# Altium schematic sheet ROLETA2-A1-P01.SchDoc
size A3
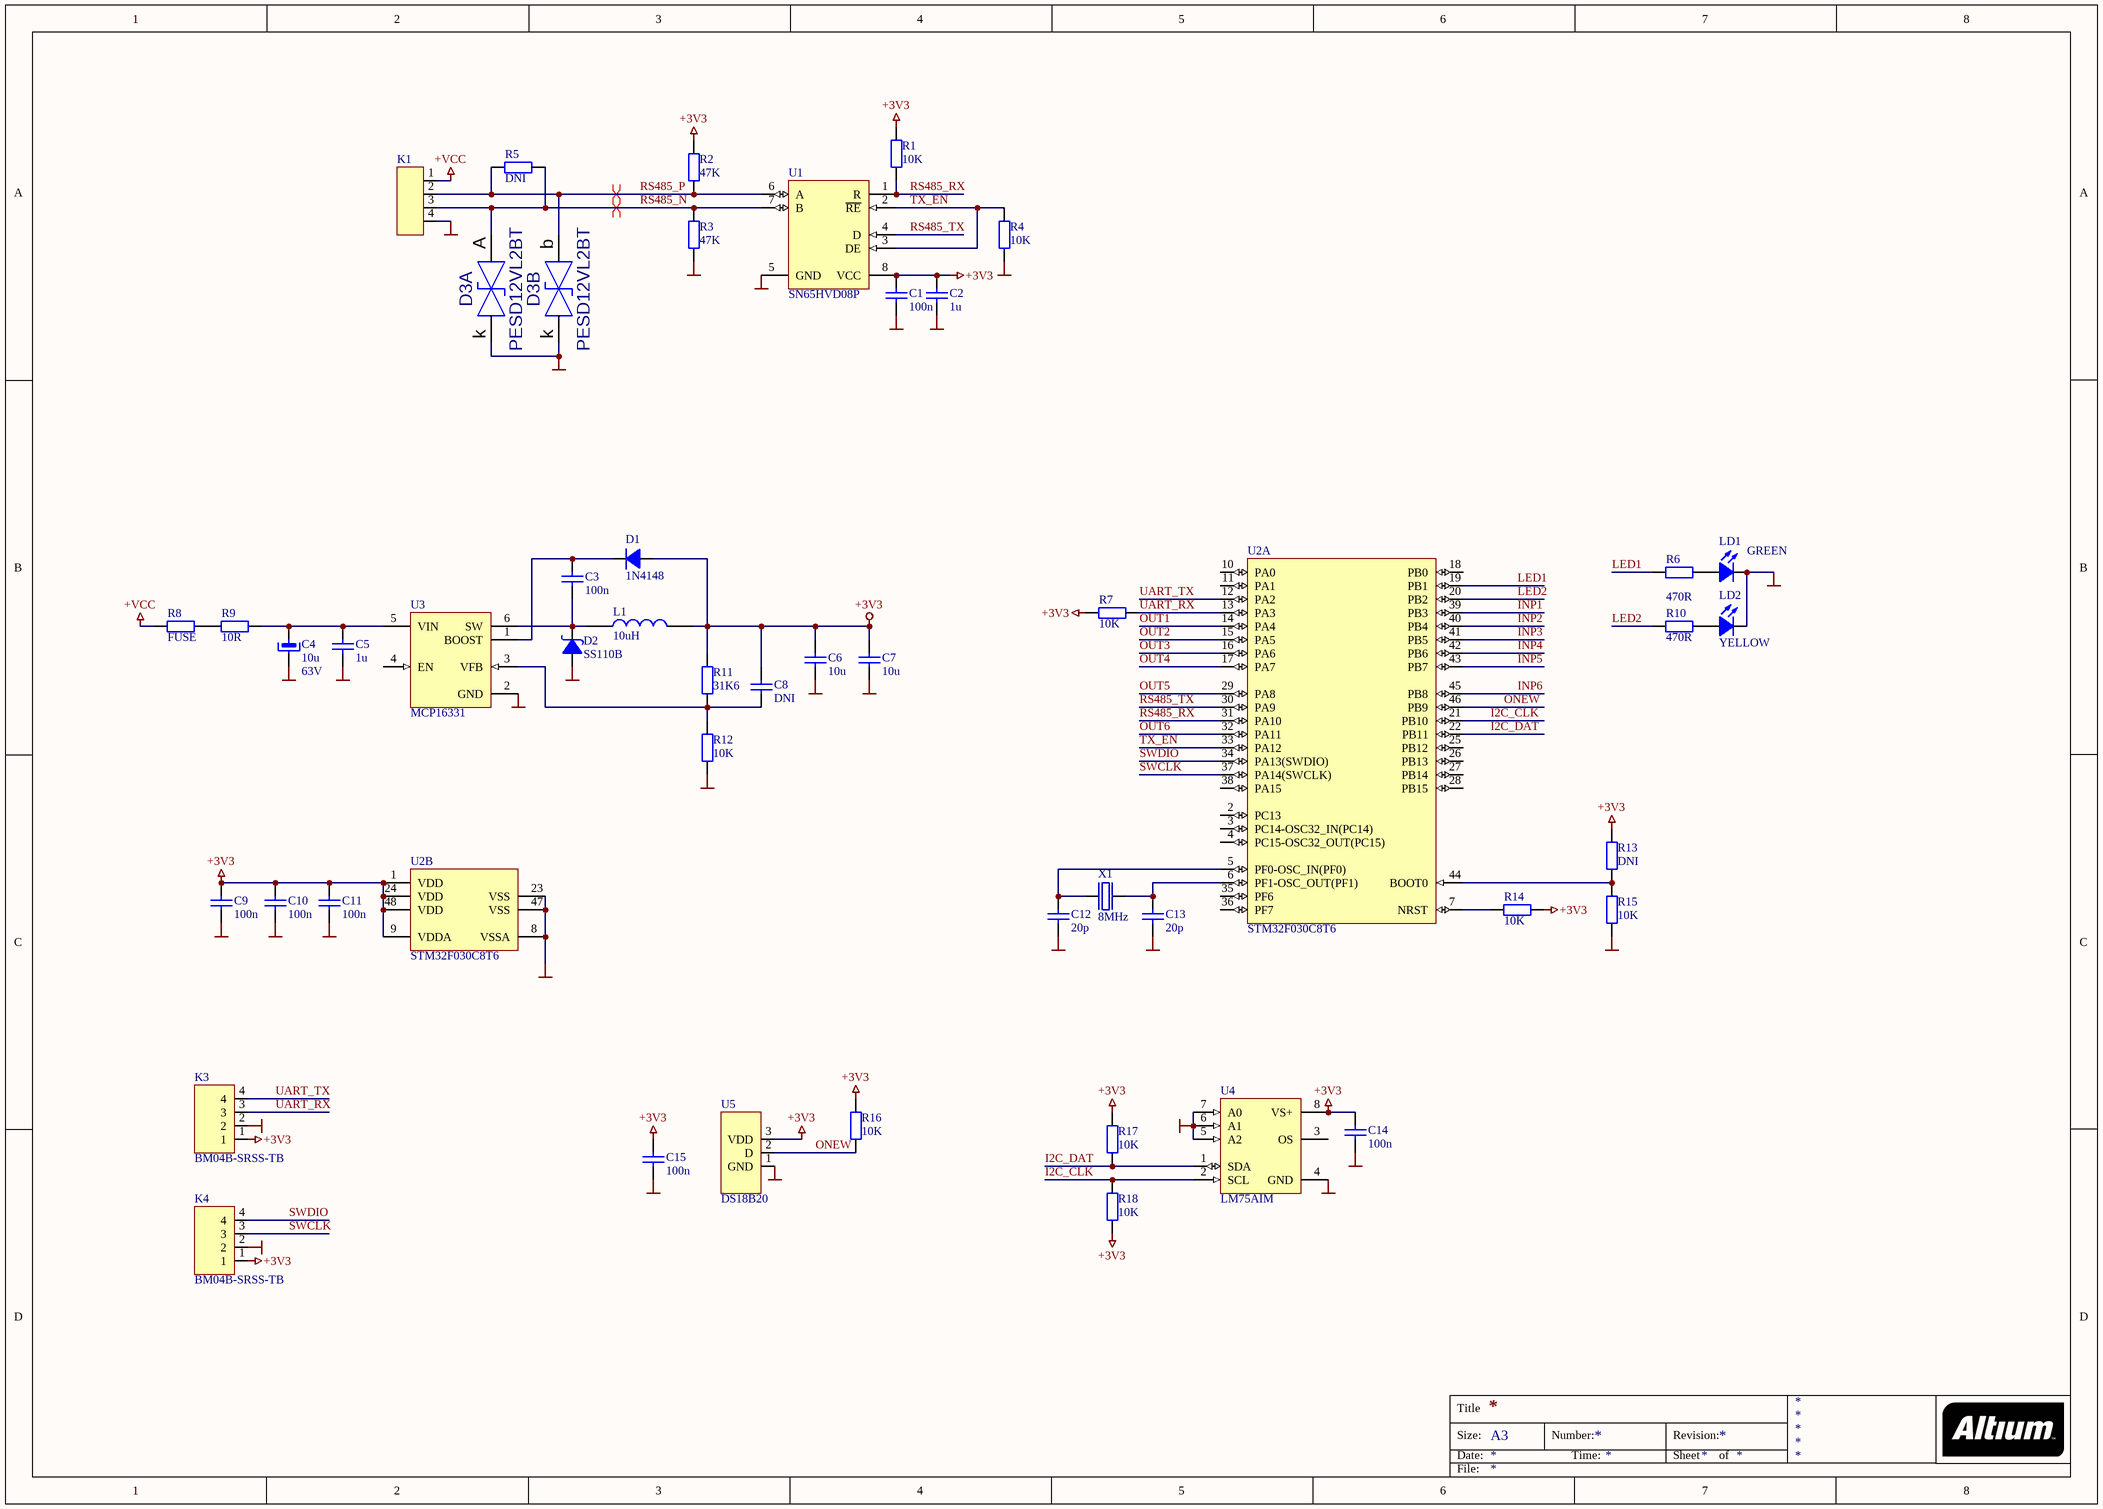
[diagram p0: ROLETA2-A1-P01.SchDoc]

## Parts
C1  100n  [CC0805-1]
C2  1u  [CC0805-1]
C3  100n  [CC0805-1]
C4  10u  Comment2: 63V  [CAPPS-D6.3X7.7]
C5  1u  [CC0805-1]
C6  10u  [CC0805-1]
C7  10u  [CC0805-1]
C8  DNI  [CC0805-1]
C9  100n  [CC0805-1]
C10  100n  [CC0805-1]
C11  100n  [CC0805-1]
C12  20p  [CC0805-1]
C13  20p  [CC0805-1]
C14  100n  [CC0805-1]
C15  100n  [CC0805-1]
D1  1N4148  [SOD323]
D2  SS110B  [DO-214AC]
D3  PESD12VL2BT  [SOT-23_NUP2105L(Primary)]  (parts A,B of 2)
K1  Terminal Block Connector, 3.81mm, Right Angle  [CONN_3.81_4]  (value not drawn)
K3  BM04B-SRSS-TB  [JST-SH-4pin]
K4  BM04B-SRSS-TB  [JST-SH-4pin]
L1  10uH  [IND-LQH32CN4R7M33l]
LD1  GREEN  [LEDGREENC190]
LD2  YELLOW  [LEDYELLOWC190]
R1  10K  [RC0805-1]
R2  47K  [RC0805-1]
R3  47K  [RC0805-1]
R4  10K  [RC0805-1]
R5  DNI  [RC0805-1]
R6  470R  [RC0805-1]
R7  10K  [RC0805-1]
R8  FUSE  [RC1206-1]
R9  10R  [RC0805-1]
R10  470R  [RC0805-1]
R11  31K6  [RC0805-1]
R12  10K  [RC0805-1]
R13  DNI  [RC0805-1]
R14  10K  [RC0805-1]
R15  10K  [RC0805-1]
R16  10K  [RC0805-1]
R17  10K  [RC0805-1]
R18  10K  [RC0805-1]
U1  SN65HVD08P  [P8]
U2  STM32F030C8T6  [STM-LQFP48_N]  (parts A,B of 2)
U3  MCP16331  [MCHP-SOT-23-CH6_N]
U4  LM75AIM  [M08A_N]
U5  DS18B20  [TO92]
X1  8MHz  [OSCCC150X320X9-2N]

## Nets
+3V3: C1.2 C2.2 C6.2 C7.2 C8.2 C9.2 C10.2 C11.2 C14.2 C15.2 D1.2(A) K3.1 K4.1 L1.2 R1.2 R2.2 R7.1 R11.2 R13.2 R14.1 R16.1 R17.1 R18.1 U1.8(VCC) U2.1(VDD) U2.9(VDDA) U2.24(VDD) U2.48(VDD) U4.8(VS+) U5.3(VDD)
+VCC: K1.1(A) R8.1
GND: C1.1 C2.1 C4.2 C5.1 C6.1 C7.1 C9.1 C10.1 C11.1 C12.1 C13.1 C14.1 C15.1 D2.A D3.k(K) K1.4(K) K3.2 K4.2 LD1.1(C) LD2.1(C) R3.1 R4.1 R12.1 R15.2 U1.5(GND) U2.8(VSSA) U2.23(VSS) U2.47(VSS) U3.2(GND) U4.4(GND) U4.5(A2) U4.6(A1) U4.7(A0) U5.1(GND)
I2C_CLK: R18.2 U2.21(PB10) U4.2(SCL)
I2C_DAT: R17.2 U2.22(PB11) U4.1(SDA)
INP1: U2.39(PB3)
INP2: U2.40(PB4)
INP3: U2.41(PB5)
INP4: U2.42(PB6)
INP5: U2.43(PB7)
INP6: U2.45(PB8)
LED1: R6.1 U2.19(PB1)
LED2: R10.1 U2.20(PB2)
ONEW: R16.2 U2.46(PB9) U5.2(D)
OUT1: U2.14(PA4)
OUT2: U2.15(PA5)
OUT3: U2.16(PA6)
OUT4: U2.17(PA7)
OUT5: U2.29(PA8)
OUT6: U2.32(PA11)
RS485_N: D3.A K1.3(A) R3.2 R5.2 U1.7(B)
RS485_P: D3.b(A) K1.2(K) R2.1 R5.1 U1.6(A)
RS485_RX: R1.1 U1.1(R) U2.31(PA10)
RS485_TX: U1.4(D) U2.30(PA9)
SWCLK: K4.3 U2.37(PA14(SWCLK))
SWDIO: K4.4 U2.34(PA13(SWDIO))
TX_EN: R4.2 U1.2(~{RE}) U1.3(DE) U2.33(PA12)
UART_RX: K3.3 R7.2 U2.13(PA3)
UART_TX: K3.4 U2.12(PA2)
NetC3_1: C3.1 D2.K L1.1 U3.6(SW)
NetC3_2: C3.2 D1.1(C) U3.1(BOOST)
NetC4_1: C4.1 C5.2 R9.1 U3.5(VIN)
NetC8_1: C8.1 R11.1 R12.2 U3.3(VFB)
NetC12_2: C12.2 U2.5(PF0-OSC_IN(PF0)) X1.1(OUT)
NetC13_2: C13.2 U2.6(PF1-OSC_OUT(PF1)) X1.2(IN)
NetLD1_2: LD1.2(A) R6.2
NetLD2_2: LD2.2(A) R10.2
NetR8_2: R8.2 R9.2
NetR13_1: R13.1 R15.1 U2.44(BOOT0)
NetR14_2: R14.2 U2.7(NRST)

Not connected (* = marked no-connect by the designer): U2 2(PC13) 3(PC14-OSC32_IN(PC14)) 4(PC15-OSC32_OUT(PC15)) 10(PA0) 11(PA1) 18(PB0) 25(PB12) 26(PB13) 27(PB14) 28(PB15) 35(PF6) 36(PF7) 38(PA15); U3 4(EN); U4 3(OS)

## Layout directives
differential pair: RS485_N, RS485_P

## Notes on the sheet
- Title
- Size:
- Date:
- A3
- Number:
- Time:
- Revision:
- Sheet
- of
- File:

## Library data of the parts
C1-C3 C5 C8 = CAPCC0805_1U50VX7R: Capacitor chip ceramic 0805; Comment2: 50V X7R 10%; Sort: 210; Tech: SMDR; Code: *; Manufacturer: *; Manufacturer No: *; Price: *; Package: Cap Chip 0805; Supplier: *; Supplier No: *
C4 = CAPPS100U25VFP: Capacitor electrolitic SMD 6.3X6.3X7.7MM low ESR; Manufacturer No: EEEFK1J100P; Sort: 230; Tech: SMDR; Package: 6.3X6.3X7.7mm; Price: 0; Supplier: Farnell; Supplier No: 9696008
C6 C7 = CAPCC0805_10U16VX5R: Capacitor chip ceramic 0805; Comment2: 16V X5R 10%; Sort: 210; Tech: SMDR; Package: Cap Chip 0805; Price: 0
C9-C15 = CAPCC0805_100N50VX7R: Capacitor chip ceramic 0805; Comment2: 50V X7R 10%; Sort: 210; Tech: SMDR; Package: Cap Chip 0805; Price: 0
D1 = D-1N4148WS: Small Signal Diode; Manufacturer: Vishay; Manufacturer No: 1N4148WS-V-GS18; Sort: 430; Comment2: 100V 150mA; Tech: SMDR; Code: *; Price: *; Package: SOD323; Supplier: Farnell; Supplier No: 1612348
D2 = CD214A-B240LF-0.3V@1A: Schottky Diode; Manufacturer: multicomp; Sort: 430; Comment2: 100V 1A; Tech: SMDR; Code: *; Manufacturer No: SS110B; Price: *; Package: DO-214AC; Supplier: Farnell; Supplier No: 1861422
D3 = NUP2105L: Diode; cena: {cena}; Value: *
K1 = CONN_TB_3.81_4PIN: Terminal Block Connector, 3.81mm, 4pin
K3 K4 = JST-SH-BM04B-SRSS-TB: JST connector 4pin vertical
L1 = LQH44PN100MP0L: Chip Inductor 4 x 4 mm; Manufacturer: Murata; Comment2: 10 uH, DC Res 0.16 Ohm, 1.17 A; Sort: 310; Code: *; Package: 1515; Price: *; Tech: *; Supplier: Farnell; Supplier No: 1782801; Manufacturer No: LQH44PN100MP0L
LD1 = LED-GREEN0603V: LED green HSMG vertical; Manufacturer: Avago; Manufacturer No: HSMG-C190; Comment2: 2.6V 20mA 15mcd 52mW; Sort: 450; Tech: SMDR; Package: Led Chip 0603; Price: 0.3; Supplier: Farnell; Supplier No: 8554609
LD2 = LED-YELLOW0603V: LED yellow HSMY vertical; Manufacturer: Avago; Manufacturer No: HSMY-C190; Comment2: 2.6V 20mA 8mcd 52mW; Sort: 450; Tech: SMDR; Package: Led Chip 0603; Price: 0.4; Supplier: Farnell; Supplier No: 8554781
R1-R7 R9-R18 = RES0805: Chip Resistor 0805; Comment2: 0.125W 1% 200ppm; Sort: 110; Tech: SMDR; Package: Res Chip 0805; Price: 0.002
R8 = RES1206: Chip Resistor 1206; Comment2: 0.25W 1% 200ppm; Sort: 110; Tech: SMDR; Package: Res Chip 1206; Price: 0.002
U1 = SN65HVD08P: 3.3 / 5 V RS-485 Transceiver, 10 Mbps, Half Duplex, -40 to 85 degC, 8-pin PDIP (P), Pb-Free (RoHS); Manufacturer: Texas Instruments; Eco-Plan: Green (RoHS & no Sb/Br); # of TX/RX: 1 TX / 1 RX; Drivers Per Package: 1; Isolated: No; Number of Nodes: 256; Signaling Rate(Mbps): 10; Common Mode Range: -7 to 12; ESD(kV): 16; Fault Protection(V): -9 to 14; Fail Safe: Idle, Open, Short; Supply Voltage(s)(V): 3.3, 5; Rating: Catalog; DatasheetVersion: SLLS550C; PackageVersion: revE, Apr-2010; PackageReference: P8; PackageDescription: 8-Pin Plastic Dual-In-Line Package, Row Spacing 7.62 mm, Pitch 2.54 mm; Supplier 1: Digi-Key; Supplier Part Number 1: 296-14011-5-ND; Supplier 2: Farnell; Supplier Part Number 2: 8452083; Supplier 3: Farnell; Supplier Part Number 3: 2118813; Supplier 4: Newark; Supplier Part Number 4: 22H0093; Supplier 5: Mouser; Supplier Part Number 5: 595-SN65HVD08P; SubFamily: RS-485; Receivers Per Package: 1; Duplex: Half; ICC(Max)(mA): 16; Footprint: SN75176; Mounting Technology: Through-hole; PartNumber: SN65HVD08P; Code_JEDEC: MS-001-BA; ComponentLink1Description: Datasheet; ComponentLink1URL: http://www.ti.com/general/docs/lit/getliterature.tsp?genericPartNumber=SN65HVD08&fileType=pdf; ComponentLink2Description: Package Specification; ComponentLink2URL: http://www.ti.com/litv/pdf/mpdi001b
U2 = STM32F030C8T6: ARM Cortex-M0 32-bit MCU, 64 KB Flash, 8 KB Internal RAM, 39 I/Os, 48-pin LQFP, -40 to 85 degC, Tray; FLASH Size (Prog) (kB): 64; I/Os (High Current): 39; Internal RAM Size (kB): 8; Operating Frequency(F) (Processor speed) (MHz): 48; Supply Voltage(Vcc) min (V): 2.4; DatasheetVersion: Rev. 1; PackageVersion: Rev. 6, 06/2013; PackageReference: LQFP48; PackageDescription: 48-Pin Low Profile Quad Flat Package, 7 x 7 mm Body, 0.5 mm Pitch; Supplier 1: Digi-Key; Supplier Part Number 1: 497-14043-ND; Supplier 2: Newark; Supplier Part Number 2: 06X3647; Supplier 3: Mouser; Supplier Part Number 3: 511-STM32F030C8T6; Core: ARM Cortex-M0; Packing: Tray; Mounting Technology: Surface Mount; PartNumber: STM32F030C8T6; ComponentLink1Description: Manufacturer URL; ComponentLink1URL: http://www.st.com/web/en/home.html; ComponentLink2Description: Datasheet; ComponentLink2URL: http://www.st.com/st-web-ui/static/active/en/resource/technical/document/datasheet/DM00088500.pdf; ComponentLink3Description: Package Specification; ComponentLink3URL: http://www.st.com/st-web-ui/static/active/en/resource/technical/document/datasheet/DM00058181.pdf
U3 = MCP16301T-E/CH: High-Voltage Input Integrated Switch Step-Down Regulator, 600 mA, Input Voltage 4.0 to 30 V, Output Voltage 2.0 to 15 V, -40 to 125 degC, 6-pin SOT-23 (CH6), Tape and Reel; Manufacturer: Microchip; DatasheetVersion: Rev. B; PackageVersion: C04-028B; PackageReference: SOT-23-CH6; PackageDescription: 6-Lead Plastic Small Outline Transistor, 2.9 x 1.55 mm Body, 0.95 mm Pitch; Supplier 1: Digi-Key; Supplier Part Number 1: MCP16331; Supplier 2: Newark; Supplier Part Number 2: 31W8729; Supplier 3: Mouser; Supplier Part Number 3: 579-MCP16301T-E/CH; Mounting Technology: Surface Mount; PartNumber: MCP16301T-E/CH; ComponentLink1Description: Manufacturer URL; ComponentLink1URL: http://www.microchip.com; ComponentLink2Description: Datasheet; ComponentLink2URL: http://ww1.microchip.com/downloads/en/DeviceDoc/25004B.pdf; ComponentLink3Description: Package Specification; ComponentLink3URL: http://www.microchip.com/stellent/groups/techpub_sg/documents/packagingspec/en012702.pdf; ComponentLink4Description: Product URL; ComponentLink4URL: http://www.microchip.com/MCP16301
U4 = LM75AIM: Digital Temperature Sensor and Thermal Watchdog with Two-Wire Interface, 8-pin Narrow SOIC; Manufacturer: National Semiconductor; PackageTopMarking: NSZXTT*LM75*AIM; PowerWise: N; CompType: Temp Sensor IC; High-Reliability: Y; DatasheetVersion: Jan-2009; PackageVersion: revM, May-2009; PackageReference: M08A; PackageDescription: SOIC Narrow, 4.9 x 3.9 x 1.45mm, 8 Lead, 1.27mm Pitch; PartNumber: LM75AIM; RoHS: Y; PinCount: 8; Code_JEDEC: MS-012-AA; Code_IPC: SOIC127P600-8; ComponentLink1Description: Manufacturer URL; ComponentLink1URL: http://www.national.com/; ComponentLink2Description: LM75 Datasheet; ComponentLink2URL: http://www.national.com/ds/LM/LM75.pdf; ComponentLink3Description: LM75 Web Page; ComponentLink3URL: http://www.national.com/pf/LM/LM75.html; ComponentLink4Description: M08A Package Page; ComponentLink4URL: http://www.national.com/packaging/folders/m08a.html
U5 = DS18B20: digital temperature sensor
X1 = XTAL-SMD_8MHz: SMD Crystal 8MHz; Code: *; Price: *; Tech: *